# EAGLE schematic Pinduino-Nano-WPC-adaptor-panalized (EAGLE 7.7.0)
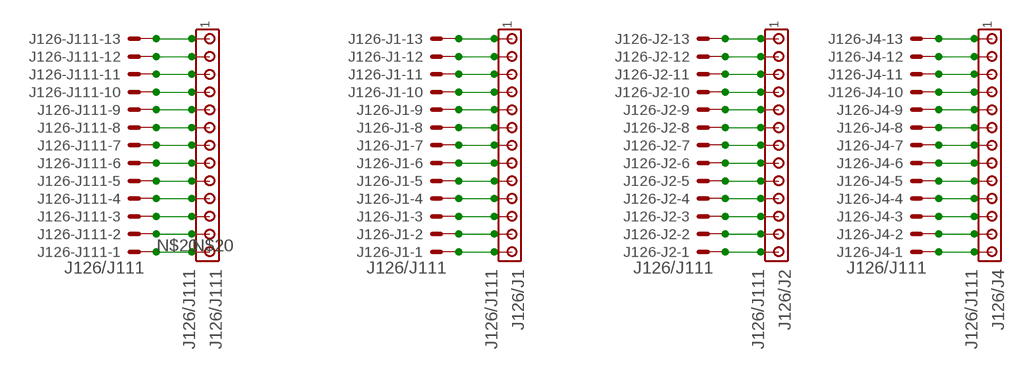
[diagram p0: schematic, sheet 1]

## Parts
J126-J1  J126/J111  KK-156-13  [KK-156-13]
J126-J2  J126/J111  KK-156-13  [KK-156-13]
J126-J4  J126/J111  KK-156-13  [KK-156-13]
J126-J111  J126/J111  KK-156-13  [KK-156-13]
J126/J1  J126/J111  MTA13-156  [1X13MTA]
J126/J2  J126/J111  MTA13-156  [1X13MTA]
J126/J4  J126/J111  MTA13-156  [1X13MTA]
J126/J111  J126/J111  MTA13-156  [1X13MTA]

## Nets
N$1: J126-J1.12 J126/J1.2
N$2: J126-J1.13 J126/J1.1
N$3: J126-J1.9 J126/J1.5
N$4: J126-J1.5 J126/J1.9
N$5: J126-J1.6 J126/J1.8
N$6: J126-J1.7 J126/J1.7
N$7: J126-J1.8 J126/J1.6
N$8: J126-J1.10 J126/J1.4
N$9: J126-J1.11 J126/J1.3
N$10: J126-J1.4 J126/J1.10
N$11: J126-J1.3 J126/J1.11
N$12: J126-J1.2 J126/J1.12
N$13: J126-J1.1 J126/J1.13
N$14: J126-J2.12 J126/J2.2
N$15: J126-J2.13 J126/J2.1
N$16: J126-J2.9 J126/J2.5
N$17: J126-J2.5 J126/J2.9
N$18: J126-J2.6 J126/J2.8
N$19: J126-J111.3 J126/J111.11
N$20: J126-J111.2 J126/J111.12
N$21: J126-J111.12 J126/J111.2
N$22: J126-J111.13 J126/J111.1
N$23: J126-J111.4 J126/J111.10
N$24: J126-J2.7 J126/J2.7
N$25: J126-J111.1 J126/J111.13
N$26: J126-J2.8 J126/J2.6
N$27: J126-J111.9 J126/J111.5
N$28: J126-J2.10 J126/J2.4
N$29: J126-J2.11 J126/J2.3
N$30: J126-J2.4 J126/J2.10
N$31: J126-J2.3 J126/J2.11
N$32: J126-J2.2 J126/J2.12
N$33: J126-J2.1 J126/J2.13
N$47: J126-J4.12 J126/J4.2
N$48: J126-J4.13 J126/J4.1
N$49: J126-J4.9 J126/J4.5
N$50: J126-J4.5 J126/J4.9
N$51: J126-J4.6 J126/J4.8
N$52: J126-J4.7 J126/J4.7
N$53: J126-J4.8 J126/J4.6
N$54: J126-J4.10 J126/J4.4
N$55: J126-J4.11 J126/J4.3
N$56: J126-J4.4 J126/J4.10
N$57: J126-J4.3 J126/J4.11
N$58: J126-J111.6 J126/J111.8
N$59: J126-J111.7 J126/J111.7
N$60: J126-J4.2 J126/J4.12
N$61: J126-J4.1 J126/J4.13
N$62: J126-J111.8 J126/J111.6
N$64: J126-J111.5 J126/J111.9
N$65: J126-J111.10 J126/J111.4
N$66: J126-J111.11 J126/J111.3

## Library data of the parts
J126-J1 J126-J2 J126-J4 J126-J111 = con-molex:KK-156-13: KK 156 HEADER Source: http://www.molex.com/pdm_docs/sd/026604100_sd.pdf; OC_FARNELL: unknown; OC_NEWARK: unknown
J126/J1 J126/J2 J126/J4 J126/J111 = con-amp:MTA13-156: AMP connector

## Net classes
0 default: width 0.406 mm
1 Power: width 0.61 mm
2 GND: width 0.61 mm